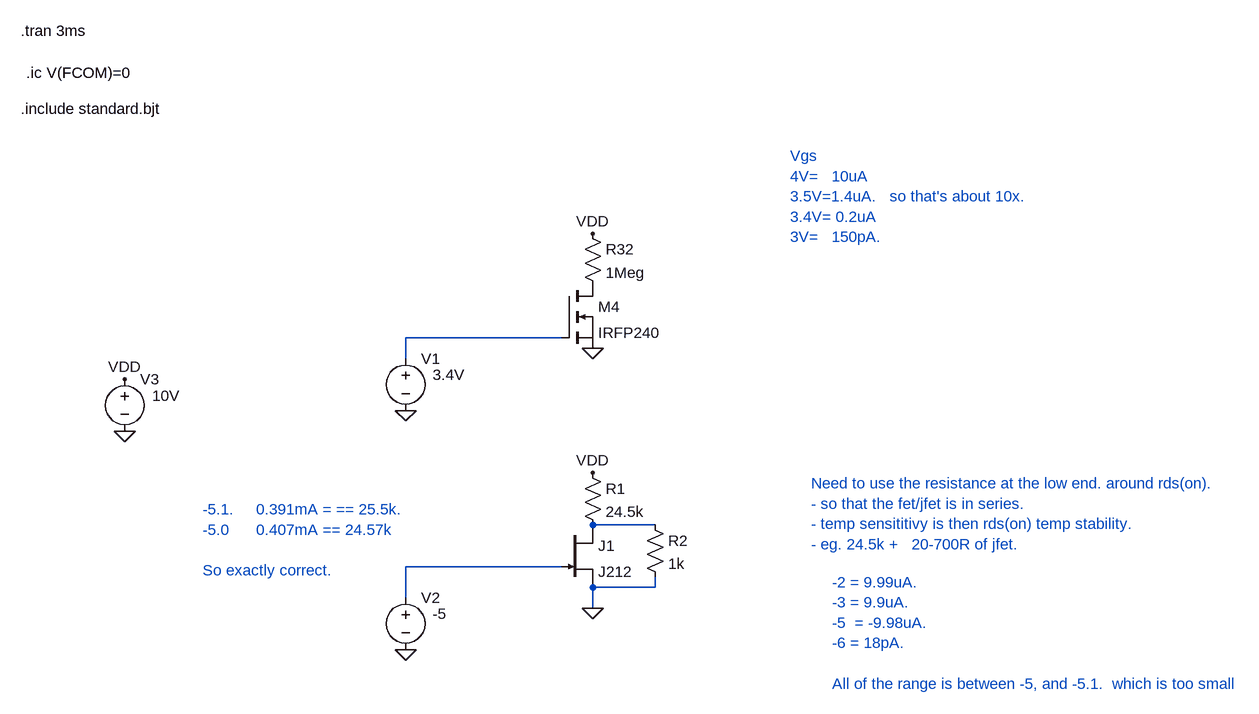
[diagram p0: schematic Draft54.asc]
Draft54.asc, the LTspice schematic file:
Version 4
SHEET 1 2756 1912
WIRE 96 48 -144 48
WIRE -144 80 -144 48
WIRE 240 336 144 336
WIRE 96 400 -144 400
WIRE 240 432 240 416
WIRE 240 432 144 432
WIRE -144 448 -144 400
WIRE 144 464 144 432
FLAG -576 112 VDD
FLAG 144 -112 VDD
FLAG -576 192 0
FLAG 144 64 0
FLAG -144 160 0
FLAG 144 256 VDD
FLAG 144 464 0
FLAG -144 528 0
SYMBOL nmos 96 -32 R0
SYMATTR InstName M4
SYMATTR Value IRFP240
SYMBOL res 128 -128 R0
SYMATTR InstName R32
SYMATTR Value 1Meg
SYMBOL voltage -576 96 R0
WINDOW 123 0 0 Left 0
WINDOW 39 0 0 Left 0
WINDOW 3 42 41 Left 2
SYMATTR Value 10V
SYMATTR InstName V3
SYMBOL voltage -144 64 R0
WINDOW 123 0 0 Left 0
WINDOW 39 0 0 Left 0
WINDOW 3 42 41 Left 2
SYMATTR Value 3.4V
SYMATTR InstName V1
SYMBOL res 128 240 R0
SYMATTR InstName R1
SYMATTR Value 24.5k
SYMBOL voltage -144 432 R0
WINDOW 123 0 0 Left 0
WINDOW 39 0 0 Left 0
WINDOW 3 42 41 Left 2
SYMATTR Value -5
SYMATTR InstName V2
SYMBOL njf 96 336 R0
SYMATTR InstName J1
SYMATTR Value J212
SYMBOL res 224 320 R0
SYMATTR InstName R2
SYMATTR Value 1k
TEXT -736 -424 Left 2 !.tran 3ms
TEXT -728 -360 Left 2 !.ic V(FCOM)=0
TEXT -736 -304 Left 2 !.include standard.bjt
TEXT 448 -232 Left 2 ;Vgs\n4V=   10uA\n3.5V=1.4uA.   so that's about 10x.\n3.4V= 0.2uA\n3V=   150pA.
TEXT 512 424 Left 2 ;-2 = 9.99uA.\n-3 = 9.9uA.\n-5  = -9.98uA.\n-6 = 18pA.\n \nAll of the range is between -5, and -5.1.  which is too small
TEXT 480 272 Left 2 ;Need to use the resistance at the low end. around rds(on).\n- so that the fet/jfet is in series. \n- temp sensititivy is then rds(on) temp stability.\n- eg. 24.5k +   20-700R of jfet.
TEXT -456 312 Left 2 ;-5.1.     0.391mA = == 25.5k.\n-5.0      0.407mA == 24.57k\n \nSo exactly correct.

The netlist it stands for:
* Draft54.asc
M4 P001 N001 0 0 IRFP240
R32 VDD P001 1Meg
V3 VDD 0 10V
V1 N001 0 3.4V
R1 VDD N002 24.5k
V2 N003 0 -5
J1 N002 N003 0 J212
R2 N002 0 1k
.model NJF NJF
.model PJF PJF
.lib standard.jft
.model NMOS NMOS
.model PMOS PMOS
.lib standard.mos
.tran 3ms
.ic V(FCOM)=0
.include standard.bjt
* Vgs
* 4V=   10uA
* 3.5V=1.4uA.   so that's about 10x.
* 3.4V= 0.2uA
* 3V=   150pA.
* -2 = 9.99uA.
* -3 = 9.9uA.
* -5  = -9.98uA.
* -6 = 18pA.
* All of the range is between -5, and -5.1.  which is too small
* Need to use the resistance at the low end. around rds(on).
* - so that the fet/jfet is in series.
* - temp sensititivy is then rds(on) temp stability.
* - eg. 24.5k +   20-700R of jfet.
* -5.1.     0.391mA = == 25.5k.
* -5.0      0.407mA == 24.57k
* So exactly correct.
.backanno
.end